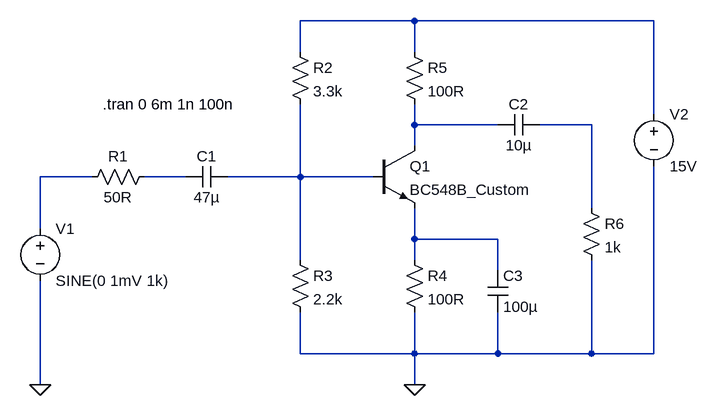
[diagram p0: schematic AMPLIFICADOR BC548B.asc]
AMPLIFICADOR BC548B.asc, the LTspice schematic file:
Version 4.1
SHEET 1 1272 680
WIRE 608 -160 432 -160
WIRE 976 -160 608 -160
WIRE 432 -112 432 -160
WIRE 608 -112 608 -160
WIRE 976 -16 976 -160
WIRE 608 0 608 -32
WIRE 736 0 608 0
WIRE 880 0 800 0
WIRE 608 32 608 0
WIRE 112 80 32 80
WIRE 256 80 192 80
WIRE 432 80 432 -32
WIRE 432 80 320 80
WIRE 544 80 432 80
WIRE 880 128 880 0
WIRE 32 160 32 80
WIRE 608 176 608 128
WIRE 736 176 608 176
WIRE 432 208 432 80
WIRE 608 208 608 176
WIRE 736 224 736 176
WIRE 432 352 432 288
WIRE 608 352 608 288
WIRE 608 352 432 352
WIRE 736 352 736 288
WIRE 736 352 608 352
WIRE 880 352 880 208
WIRE 880 352 736 352
WIRE 976 352 976 64
WIRE 976 352 880 352
WIRE 32 400 32 240
WIRE 608 400 608 352
FLAG 608 400 0
FLAG 32 400 0
SYMBOL voltage 32 144 R0
WINDOW 123 0 0 Left 0
WINDOW 39 0 0 Left 0
SYMATTR InstName V1
SYMATTR Value SINE(0 1mV 1k)
SYMBOL res 208 64 R90
WINDOW 0 0 56 VBottom 2
WINDOW 3 32 56 VTop 2
SYMATTR InstName R1
SYMATTR Value 50R
SYMBOL cap 320 64 R90
WINDOW 0 0 32 VBottom 2
WINDOW 3 32 32 VTop 2
SYMATTR InstName C1
SYMATTR Value 47µ
SYMBOL res 416 -128 R0
SYMATTR InstName R2
SYMATTR Value 3.3k
SYMBOL res 416 192 R0
SYMATTR InstName R3
SYMATTR Value 2.2k
SYMBOL res 592 192 R0
SYMATTR InstName R4
SYMATTR Value 100R
SYMBOL res 864 112 R0
SYMATTR InstName R6
SYMATTR Value 1k
SYMBOL cap 800 -16 R90
WINDOW 0 0 32 VBottom 2
WINDOW 3 32 32 VTop 2
SYMATTR InstName C2
SYMATTR Value 10µ
SYMBOL voltage 976 -32 R0
WINDOW 123 0 0 Left 0
WINDOW 39 0 0 Left 0
SYMATTR InstName V2
SYMATTR Value 15V
SYMBOL cap 720 224 R0
SYMATTR InstName C3
SYMATTR Value 100µ
SYMBOL npn 544 32 R0
SYMATTR InstName Q1
SYMATTR Value BC548B_Custom
SYMBOL res 592 -128 R0
SYMATTR InstName R5
SYMATTR Value 100R
TEXT 128 -32 Left 2 !.tran 0 6m 1n 100n

The netlist it stands for:
* AMPLIFICADOR BC548B.asc
V1 N004 0 SINE(0 1mV 1k)
R1 N005 N004 50R
C1 N006 N005 47µ
R2 N001 N006 3.3k
R3 N006 0 2.2k
R4 N007 0 100R
R6 N003 0 1k
C2 N003 N002 10µ
V2 N001 0 15V
C3 N007 0 100µ
Q1 N002 N006 N007 0 BC548B_Custom
R5 N001 N002 100R
.model NPN NPN
.model PNP PNP
.lib standard.bjt
.tran 0 6m 1n 100n
.backanno
.end